# Altium schematic sheet Sheet - DAC.SchDoc
size A4
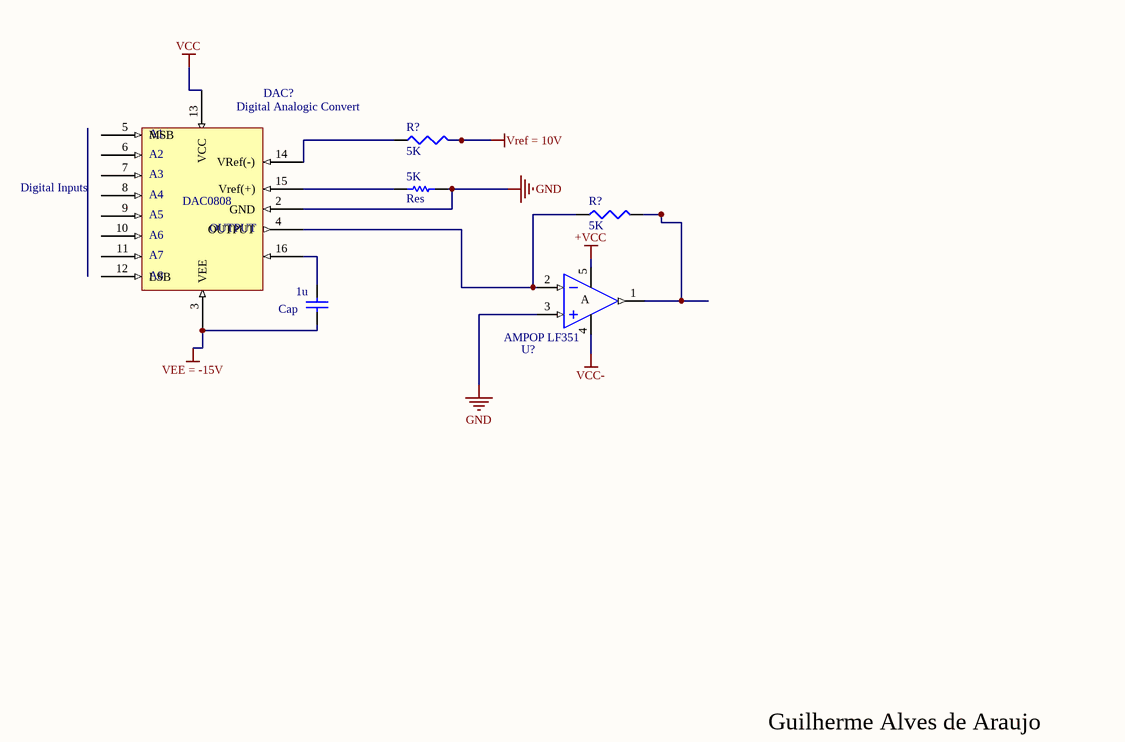
[diagram p0: Sheet - DAC.SchDoc]

## Parts
(Parts that share a designator on the sheet are numbered #1, #2 ... from top to bottom, then left to right.)
1u  Cap  [CC1005-0402]
5K  Res  [CR1005-0402_NP]
DAC?  Digital Analogic Convert
R?#1  5K  [J1-0603]
R?#2  5K  [J1-0603]
U?  AMPOP LF351

## Nets
+VCC: U?.5
GND: 5K.2 DAC?.2(GND) U?.3(IN+)
VCC: DAC?.13(VCC)
VCC-: U?.4
VEE = -15V: 1u.1 DAC?.3(VEE)
Vref = 10V: R?#1.2
Net1u_2: 1u.2 DAC?.16
Net5K_1: 5K.1 DAC?.15(Vref(+))
NetDAC?_4: DAC?.4(OUTPUT) R?#2.1 U?.2(IN-)
NetDAC?_14: DAC?.14(VRef(-)) R?#1.1
NetR?#2_2: R?#2.2 U?.1(OUT)

Not connected (* = marked no-connect by the designer): DAC? 5(MSB) 6 7 8 9 10 11 12(LSB)

## Notes on the sheet
- (near DAC?) Digital Inputs
- Guilherme Alves de Araujo
- (in symbol AMPOP) A
- (in symbol DAC) A1; A2; A3; A4; DAC0808; A5; A6; A7; A8

## Library data of the parts
1u = Capacitor: eVendor: *; eVendor Price: *; eVendor Part#: *; Manufacturer: *; Part#: *; MOQ: *; MSRP: *; NP: NP
5K = Resistor: eVendor: *; eVendor Price: *; Manufacturer: *; MSRP: *; MOQ: *; Part#: *; NP: NP
DAC? = DAC: IC CONVERTER D/A 8BIT 16-SOIC; eVendorPart#: DAC0808LCM/NOPB-ND; Manufacturer: Texas Instruments; eVendor: DAC0808LCM/NOPB; eVendorPrice: 2,31; MSRP: 1,13680; MOQ: 1000; Part#: DAC0808LCM/NOPB
R?#1 R?#2 = Res3: Resistor; Value: 1K; Published: 8-Jun-2000; LatestRevisionDate: 29-May-2009; LatestRevisionNote: IPC-7351 Footprint Added.; PackageReference: J1-0603; Publisher: Altium Limited; PackageDescription: Chip Resistor
U? = AMPOP: IC OPAMP JFET 4MHZ 8SO; Manufacturer: STMicroelectronics; eVendorPart#: 497-4041-1-ND; Part: LF351DT; eVendor: digikey; eVendorPrice: 0,65; MSRP: 0,25214; MOQ: 1000